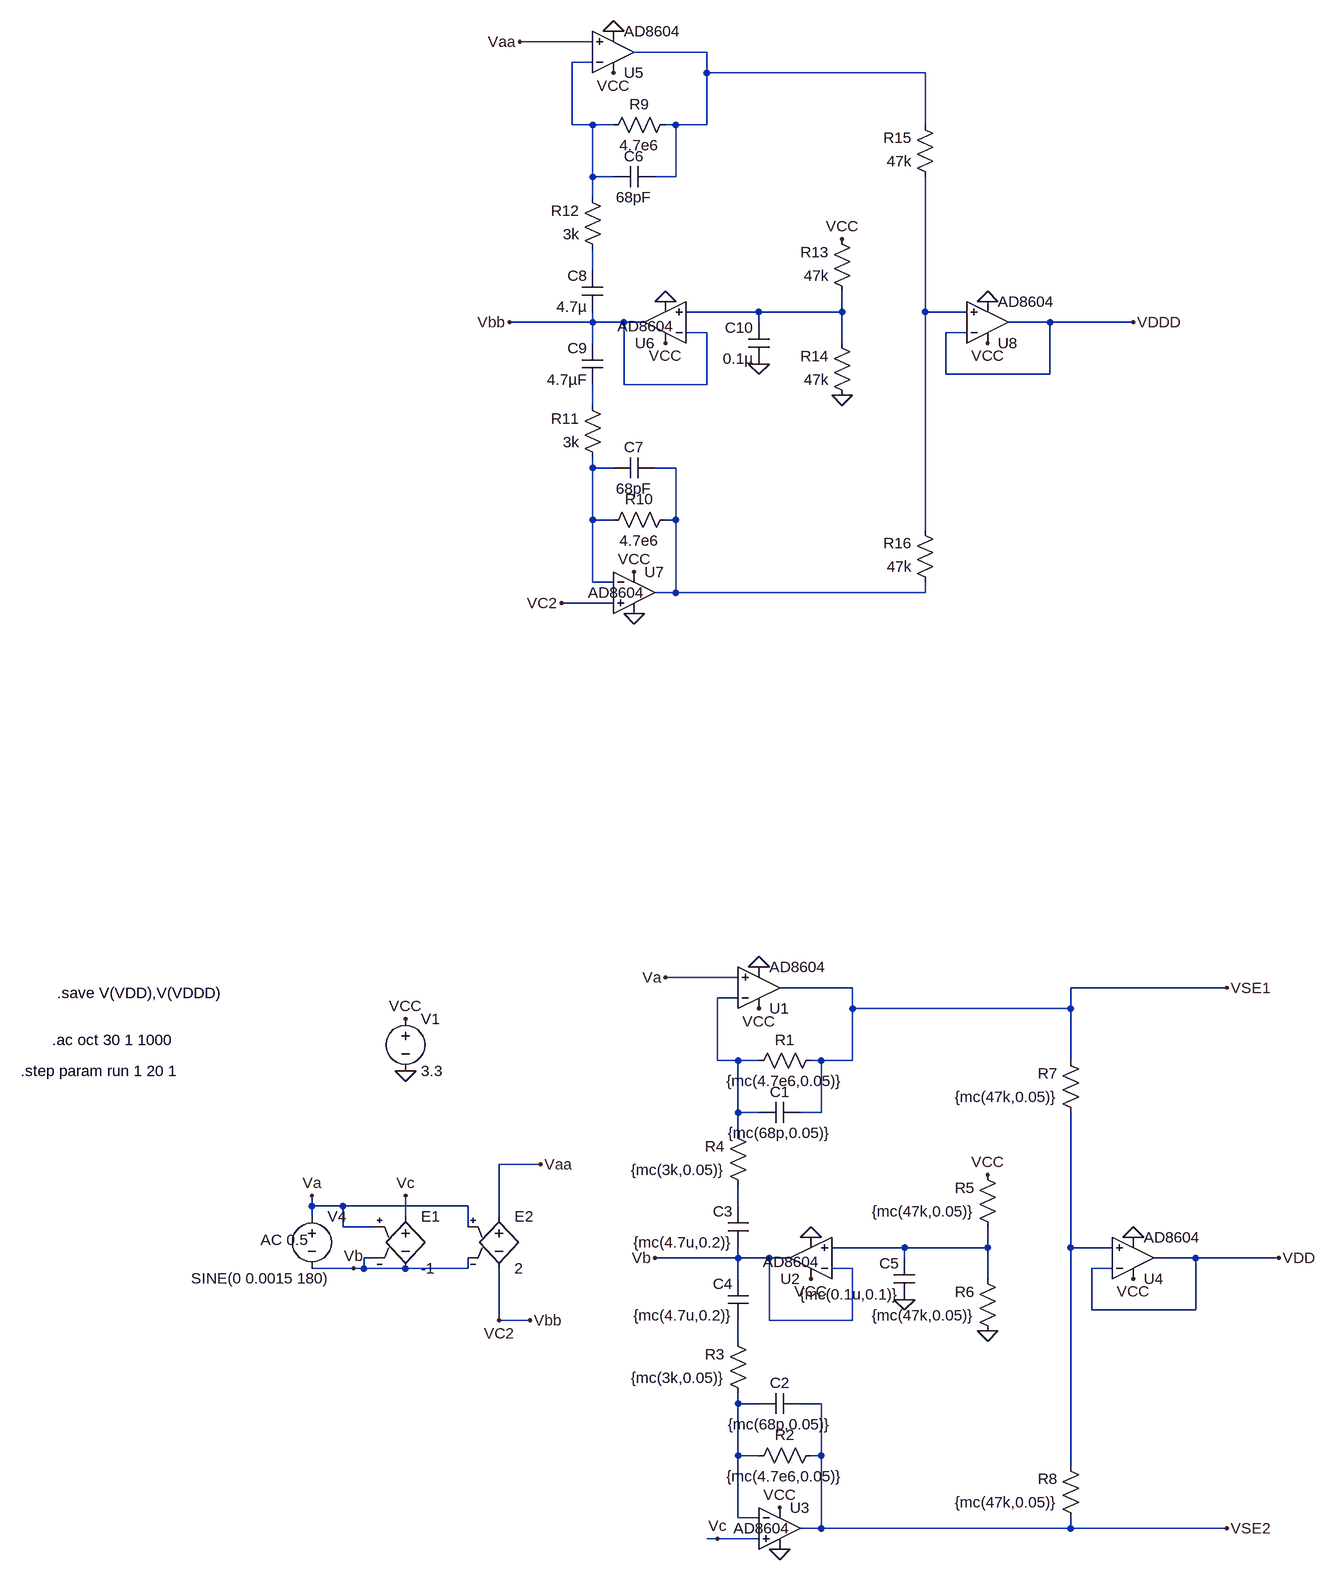
[diagram p0: schematic DDA_AD8604CMG.asc]
DDA_AD8604CMG.asc, the LTspice schematic file:
Version 4
SHEET 1 1816 824
WIRE -80 -1760 -192 -1760
WIRE 96 -1744 -16 -1744
WIRE -80 -1728 -112 -1728
WIRE 96 -1712 96 -1744
WIRE 432 -1712 96 -1712
WIRE -112 -1632 -112 -1728
WIRE -80 -1632 -112 -1632
WIRE -48 -1632 -80 -1632
WIRE 48 -1632 32 -1632
WIRE 96 -1632 96 -1712
WIRE 96 -1632 48 -1632
WIRE 432 -1632 432 -1712
WIRE -80 -1552 -80 -1632
WIRE -48 -1552 -80 -1552
WIRE 48 -1552 48 -1632
WIRE 48 -1552 16 -1552
WIRE -80 -1520 -80 -1552
WIRE -80 -1408 -80 -1440
WIRE 176 -1344 64 -1344
WIRE 304 -1344 304 -1376
WIRE 304 -1344 176 -1344
WIRE 432 -1344 432 -1552
WIRE 496 -1344 432 -1344
WIRE -80 -1328 -80 -1344
WIRE -80 -1328 -208 -1328
WIRE -32 -1328 -80 -1328
WIRE 0 -1328 -32 -1328
WIRE 176 -1328 176 -1344
WIRE 624 -1328 560 -1328
WIRE 752 -1328 624 -1328
WIRE 96 -1312 64 -1312
WIRE 496 -1312 464 -1312
WIRE -80 -1296 -80 -1328
WIRE 304 -1296 304 -1344
WIRE 464 -1248 464 -1312
WIRE 624 -1248 624 -1328
WIRE 624 -1248 464 -1248
WIRE -32 -1232 -32 -1328
WIRE 96 -1232 96 -1312
WIRE 96 -1232 -32 -1232
WIRE -80 -1200 -80 -1232
WIRE -80 -1104 -80 -1120
WIRE -48 -1104 -80 -1104
WIRE 48 -1104 16 -1104
WIRE -80 -1024 -80 -1104
WIRE -48 -1024 -80 -1024
WIRE 48 -1024 48 -1104
WIRE 48 -1024 32 -1024
WIRE 432 -1008 432 -1344
WIRE -80 -928 -80 -1024
WIRE -48 -928 -80 -928
WIRE 48 -912 48 -1024
WIRE 48 -912 16 -912
WIRE 432 -912 432 -928
WIRE 432 -912 48 -912
WIRE -48 -896 -128 -896
WIRE 144 -320 32 -320
WIRE 320 -304 208 -304
WIRE 896 -304 656 -304
WIRE 144 -288 112 -288
WIRE 320 -272 320 -304
WIRE 656 -272 656 -304
WIRE 656 -272 320 -272
WIRE 112 -192 112 -288
WIRE 144 -192 112 -192
WIRE 176 -192 144 -192
WIRE 272 -192 256 -192
WIRE 320 -192 320 -272
WIRE 320 -192 272 -192
WIRE 656 -192 656 -272
WIRE 144 -112 144 -192
WIRE 176 -112 144 -112
WIRE 272 -112 272 -192
WIRE 272 -112 240 -112
WIRE 144 -80 144 -112
WIRE -160 -32 -224 -32
WIRE -512 32 -512 16
WIRE -464 32 -512 32
WIRE -272 32 -464 32
WIRE 144 32 144 0
WIRE -512 48 -512 32
WIRE -368 48 -368 16
WIRE -224 48 -224 -32
WIRE -464 64 -464 32
WIRE -416 64 -464 64
WIRE -272 64 -272 32
WIRE 400 96 288 96
WIRE 528 96 528 64
WIRE 528 96 400 96
WIRE 656 96 656 -112
WIRE 720 96 656 96
WIRE -416 112 -432 112
WIRE 144 112 144 96
WIRE 144 112 16 112
WIRE 192 112 144 112
WIRE 224 112 192 112
WIRE 400 112 400 96
WIRE 848 112 784 112
WIRE 976 112 848 112
WIRE -448 128 -512 128
WIRE -432 128 -432 112
WIRE -432 128 -448 128
WIRE -368 128 -432 128
WIRE -272 128 -272 112
WIRE -272 128 -368 128
WIRE 320 128 288 128
WIRE 720 128 688 128
WIRE 144 144 144 112
WIRE 528 144 528 96
WIRE 688 192 688 128
WIRE 848 192 848 112
WIRE 848 192 688 192
WIRE -224 208 -224 128
WIRE -176 208 -224 208
WIRE 192 208 192 112
WIRE 320 208 320 128
WIRE 320 208 192 208
WIRE 144 240 144 208
WIRE 144 336 144 320
WIRE 176 336 144 336
WIRE 272 336 240 336
WIRE 144 416 144 336
WIRE 176 416 144 416
WIRE 272 416 272 336
WIRE 272 416 256 416
WIRE 656 432 656 96
WIRE 144 512 144 416
WIRE 176 512 144 512
WIRE 272 528 272 416
WIRE 272 528 240 528
WIRE 656 528 656 512
WIRE 656 528 272 528
WIRE 896 528 656 528
WIRE 112 544 96 544
WIRE 176 544 112 544
FLAG -368 -176 0
FLAG 400 176 0
FLAG 528 224 0
FLAG -368 -256 VCC
FLAG 176 -272 VCC
FLAG 208 496 VCC
FLAG 208 560 0
FLAG 752 144 VCC
FLAG 256 80 0
FLAG 752 80 0
FLAG 176 -336 0
FLAG 528 -16 VCC
FLAG 32 -320 Va
FLAG 976 112 VDD
FLAG 896 -304 VSE1
FLAG 896 528 VSE2
FLAG -512 16 Va
FLAG -368 16 Vc
FLAG 16 112 Vb
FLAG -448 128 Vb
FLAG 256 144 VCC
FLAG 112 544 Vc
FLAG 176 -1264 0
FLAG 304 -1216 0
FLAG -48 -1712 VCC
FLAG -16 -944 VCC
FLAG -16 -880 0
FLAG 528 -1296 VCC
FLAG 32 -1360 0
FLAG 528 -1360 0
FLAG -48 -1776 0
FLAG 304 -1456 VCC
FLAG -192 -1760 Vaa
FLAG -128 -896 VC2
FLAG 752 -1328 VDDD
FLAG -208 -1328 Vbb
FLAG 32 -1296 VCC
FLAG -224 208 VC2
FLAG -176 208 Vbb
FLAG -160 -32 Vaa
SYMBOL cap 240 -128 R90
WINDOW 0 0 32 VBottom 2
WINDOW 3 32 32 VTop 2
SYMATTR InstName C1
SYMATTR Value {mc(68p,0.05)}
SYMBOL cap 240 320 R90
WINDOW 0 0 32 VBottom 2
WINDOW 3 32 32 VTop 2
SYMATTR InstName C2
SYMATTR Value {mc(68p,0.05)}
SYMBOL cap 160 96 R180
WINDOW 0 24 56 Left 2
WINDOW 3 24 8 Left 2
SYMATTR InstName C3
SYMATTR Value {mc(4.7u,0.2)}
SYMBOL cap 160 208 R180
WINDOW 0 24 56 Left 2
WINDOW 3 24 8 Left 2
SYMATTR InstName C4
SYMATTR Value {mc(4.7u,0.2)}
SYMBOL cap 416 176 R180
WINDOW 0 24 56 Left 2
WINDOW 3 24 8 Left 2
SYMATTR InstName C5
SYMATTR Value {mc(0.1u,0.1)}
SYMBOL res 272 -208 R90
WINDOW 0 0 56 VBottom 2
WINDOW 3 32 56 VTop 2
SYMATTR InstName R1
SYMATTR Value {mc(4.7e6,0.05)}
SYMBOL res 272 400 R90
WINDOW 0 0 56 VBottom 2
WINDOW 3 32 56 VTop 2
SYMATTR InstName R2
SYMATTR Value {mc(4.7e6,0.05)}
SYMBOL res 160 336 R180
WINDOW 0 36 76 Left 2
WINDOW 3 36 40 Left 2
SYMATTR InstName R3
SYMATTR Value {mc(3k,0.05)}
SYMBOL res 160 16 R180
WINDOW 0 36 76 Left 2
WINDOW 3 36 40 Left 2
SYMATTR InstName R4
SYMATTR Value {mc(3k,0.05)}
SYMBOL res 544 80 R180
WINDOW 0 36 76 Left 2
WINDOW 3 36 40 Left 2
SYMATTR InstName R5
SYMATTR Value {mc(47k,0.05)}
SYMBOL res 544 240 R180
WINDOW 0 36 76 Left 2
WINDOW 3 36 40 Left 2
SYMATTR InstName R6
SYMATTR Value {mc(47k,0.05)}
SYMBOL res 672 -96 R180
WINDOW 0 36 76 Left 2
WINDOW 3 36 40 Left 2
SYMATTR InstName R7
SYMATTR Value {mc(47k,0.05)}
SYMBOL res 672 528 R180
WINDOW 0 36 76 Left 2
WINDOW 3 36 40 Left 2
SYMATTR InstName R8
SYMATTR Value {mc(47k,0.05)}
SYMBOL voltage -512 32 R0
WINDOW 123 -79 52 Left 2
WINDOW 39 0 0 Left 0
WINDOW 3 -186 111 Left 2
SYMATTR Value2 AC 0.5
SYMATTR Value SINE(0 0.0015 180)
SYMATTR InstName V4
SYMBOL voltage -368 -272 R0
WINDOW 123 0 0 Left 0
WINDOW 39 0 0 Left 0
SYMATTR InstName V1
SYMATTR Value 3.3
SYMBOL OpAmps\\AD8604 176 -240 M180
SYMATTR InstName U1
SYMBOL OpAmps\\AD8604 256 176 R180
WINDOW 3 -13 58 Left 2
SYMATTR InstName U2
SYMBOL OpAmps\\AD8604 208 464 R0
WINDOW 3 -71 64 Left 2
SYMATTR InstName U3
SYMBOL OpAmps\\AD8604 752 176 M180
SYMATTR InstName U4
SYMBOL e -368 32 R0
SYMATTR InstName E1
SYMATTR Value -1
SYMBOL cap 16 -1568 R90
WINDOW 0 0 32 VBottom 2
WINDOW 3 32 32 VTop 2
SYMATTR InstName C6
SYMATTR Value 68pF
SYMBOL cap 16 -1120 R90
WINDOW 0 0 32 VBottom 2
WINDOW 3 32 32 VTop 2
SYMATTR InstName C7
SYMATTR Value 68pF
SYMBOL cap -64 -1344 R180
WINDOW 0 24 56 Left 2
WINDOW 3 24 8 Left 2
SYMATTR InstName C8
SYMATTR Value 4.7µ
SYMBOL cap -64 -1232 R180
WINDOW 0 24 56 Left 2
WINDOW 3 24 8 Left 2
SYMATTR InstName C9
SYMATTR Value 4.7µF
SYMBOL cap 192 -1264 R180
WINDOW 0 24 56 Left 2
WINDOW 3 24 8 Left 2
SYMATTR InstName C10
SYMATTR Value 0.1µ
SYMBOL res 48 -1648 R90
WINDOW 0 0 56 VBottom 2
WINDOW 3 32 56 VTop 2
SYMATTR InstName R9
SYMATTR Value 4.7e6
SYMBOL res 48 -1040 R90
WINDOW 0 0 56 VBottom 2
WINDOW 3 32 56 VTop 2
SYMATTR InstName R10
SYMATTR Value 4.7e6
SYMBOL res -64 -1104 R180
WINDOW 0 36 76 Left 2
WINDOW 3 36 40 Left 2
SYMATTR InstName R11
SYMATTR Value 3k
SYMBOL res -64 -1424 R180
WINDOW 0 36 76 Left 2
WINDOW 3 36 40 Left 2
SYMATTR InstName R12
SYMATTR Value 3k
SYMBOL res 320 -1360 R180
WINDOW 0 36 76 Left 2
WINDOW 3 36 40 Left 2
SYMATTR InstName R13
SYMATTR Value 47k
SYMBOL res 320 -1200 R180
WINDOW 0 36 76 Left 2
WINDOW 3 36 40 Left 2
SYMATTR InstName R14
SYMATTR Value 47k
SYMBOL res 448 -1536 R180
WINDOW 0 36 76 Left 2
WINDOW 3 36 40 Left 2
SYMATTR InstName R15
SYMATTR Value 47k
SYMBOL res 448 -912 R180
WINDOW 0 36 76 Left 2
WINDOW 3 36 40 Left 2
SYMATTR InstName R16
SYMATTR Value 47k
SYMBOL e -224 32 R0
SYMATTR InstName E2
SYMATTR Value 2
SYMBOL OpAmps\\AD8604 -48 -1680 M180
SYMATTR InstName U5
SYMBOL OpAmps\\AD8604 32 -1264 R180
WINDOW 3 -13 58 Left 2
SYMATTR InstName U6
SYMBOL OpAmps\\AD8604 -16 -976 R0
WINDOW 3 -71 64 Left 2
SYMATTR InstName U7
SYMBOL OpAmps\\AD8604 528 -1264 M180
SYMATTR InstName U8
TEXT -912 -224 Left 2 !.ac oct 30 1 1000
TEXT -960 -176 Left 2 !.step param run 1 20 1
TEXT -904 -296 Left 2 !.save V(VDD),V(VDDD)

The netlist it stands for:
* DDA_AD8604CMG.asc
C1 VSE1 N009 {mc(68p,0.05)}
C2 VSE2 N014 {mc(68p,0.05)}
C3 Vb N010 {mc(4.7u,0.2)}
C4 N013 Vb {mc(4.7u,0.2)}
C5 0 N011 {mc(0.1u,0.1)}
R1 VSE1 N009 {mc(4.7e6,0.05)}
R2 VSE2 N014 {mc(4.7e6,0.05)}
R3 N014 N013 {mc(3k,0.05)}
R4 N010 N009 {mc(3k,0.05)}
R5 N011 VCC {mc(47k,0.05)}
R6 0 N011 {mc(47k,0.05)}
R7 N012 VSE1 {mc(47k,0.05)}
R8 VSE2 N012 {mc(47k,0.05)}
V4 Va Vb SINE(0 0.0015 180) AC 0.5
V1 VCC 0 3.3
XU1 Va N009 VCC 0 VSE1 AD8604  ; pins In+ In- V+ V- OUT
XU2 N011 Vb VCC 0 Vb AD8604  ; pins In+ In- V+ V- OUT
XU3 Vc N014 VCC 0 VSE2 AD8604  ; pins In+ In- V+ V- OUT
XU4 N012 VDD VCC 0 VDD AD8604  ; pins In+ In- V+ V- OUT
E1 Vc Vb Va Vb -1
C6 N001 N002 68pF
C7 N008 N007 68pF
C8 Vbb N003 4.7µ
C9 N006 Vbb 4.7µF
C10 0 N004 0.1µ
R9 N001 N002 4.7e6
R10 N008 N007 4.7e6
R11 N007 N006 3k
R12 N003 N002 3k
R13 N004 VCC 47k
R14 0 N004 47k
R15 N005 N001 47k
R16 N008 N005 47k
E2 Vaa Vbb Va Vb 2
XU5 Vaa N002 VCC 0 N001 AD8604  ; pins In+ In- V+ V- OUT
XU6 N004 Vbb VCC 0 Vbb AD8604  ; pins In+ In- V+ V- OUT
XU7 Vbb N007 VCC 0 N008 AD8604  ; pins In+ In- V+ V- OUT
XU8 N005 VDDD VCC 0 VDDD AD8604  ; pins In+ In- V+ V- OUT
.ac oct 30 1 1000
.step param run 1 20 1
.save V(VDD),V(VDDD)
.backanno
.end